# Altium schematic sheet Sheet1.SchDoc
size A4
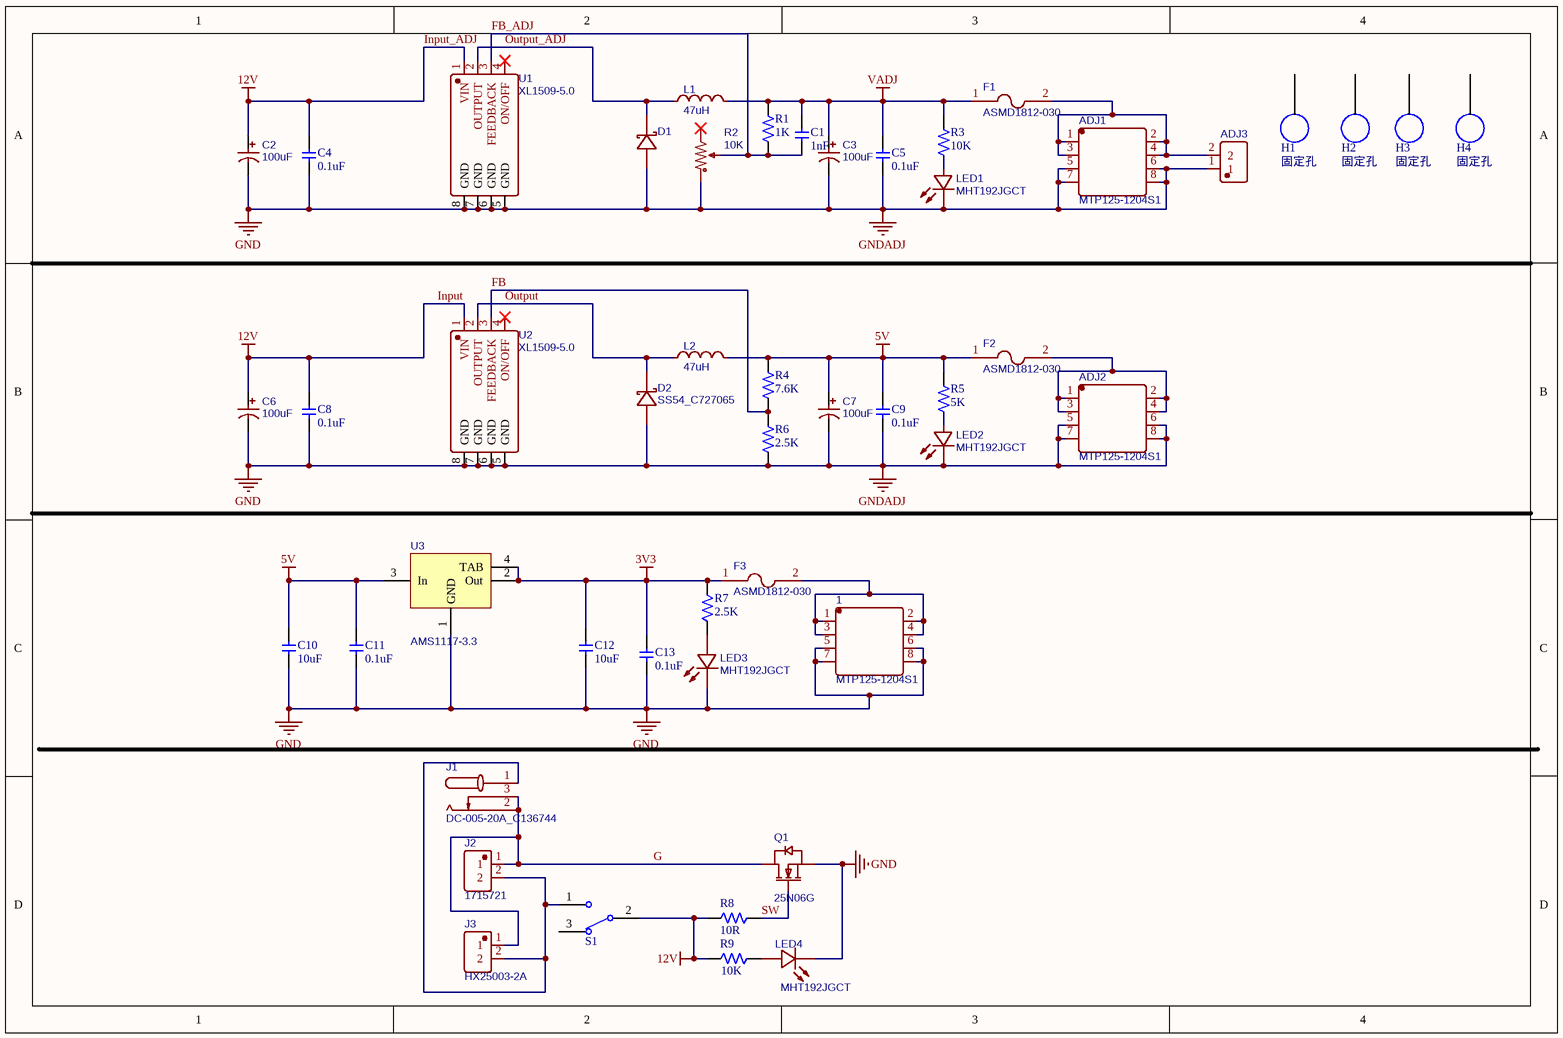
[diagram p0: Sheet1.SchDoc]

## Parts
1  MTP125-1204S1  [HDR-TH_8P-P2.54-V-F-R2-C4-S2.54-1]
ADJ1  MTP125-1204S1  [HDR-TH_8P-P2.54-V-F-R2-C4-S2.54-1]
ADJ2  MTP125-1204S1  [HDR-TH_8P-P2.54-V-F-R2-C4-S2.54-1]
ADJ3  1125-1102G0S116C001  [焊盘 2p]  (value not drawn)
C1  1nF  [0603C]
C2  100uF  [CAP-SMD_BD6.3-L6.6-W6.6-FD]
C3  100uF  [CAP-SMD_BD6.3-L6.6-W6.6-FD]
C4  0.1uF  [0603C]
C5  0.1uF  [0603C]
C6  100uF  [CAP-SMD_BD6.3-L6.6-W6.6-FD]
C7  100uF  [CAP-SMD_BD6.3-L6.6-W6.6-FD]
C8  0.1uF  [0603C]
C9  0.1uF  [0603C]
C10  10uF  [0603C]
C11  0.1uF  [0603C]
C12  10uF  [0603C]
C13  0.1uF  [0603C]
D1  SS54_C727065  [SMA_L4.3-W2.6-LS5.0-RD]  (value not drawn)
D2  SS54_C727065  [SMA_L4.3-W2.6-LS5.0-RD]
F1  ASMD1812-030  [F1812]
F2  ASMD1812-030  [F1812]
F3  ASMD1812-030  [F1812]
H1  固定孔  [Gp-t]
H2  固定孔  [Gp-t]
H3  固定孔  [Gp-t]
H4  固定孔  [Gp-t]
J1  DC-005-20A_C136744  [DC-IN-TH_DC-005-20A]
J2  1715721  [KF301-5.0-2P]
J3  HX25003-2A  [XH2.54-WI-2P]
L1  47uH  [IND-SMD_L7.1-W6.6]
L2  47uH  [IND-SMD_L7.1-W6.6]
LED1  MHT192JGCT  [LED0603-RD]
LED2  MHT192JGCT  [LED0603-RD]
LED3  MHT192JGCT  [LED0603-RD]
LED4  MHT192JGCT  [LED0603-RD]
Q1  25N06G  [TO-252-2_L6.6-W6.1-P4.57-LS9.9-BR-CW]
R1  1K  [0603R]
R2  10K  [RES-ADJ-TH_3P-L10.0-W10.0-P2.50-L]
R3  10K  [0603R]
R4  7.6K  [0603R]
R5  5K  [0603R]
R6  2.5K  [0603R]
R7  2.5K  [0603R]
R8  10R  [0603R]
R9  10K  [0603R]
S1  SW-SPDT  [钮子开关]  (value not drawn)
U1  XL1509-5.0  [SOIC-8_L5.0-W4.0-P1.27-LS6.0-BL]
U2  XL1509-5.0  [SOIC-8_L5.0-W4.0-P1.27-LS6.0-BL]
U3  AMS1117-3.3  [AMS1117]

## Nets
3V3: C12.2 C13.2 F3.1 R7.1 U3.2(Out) U3.4(TAB)
5V: C7.1 C9.2 C10.2 C11.2 F2.1 L2.2 R4.1 R5.1 U3.3(In)
GND: 1.5 1.6 1.7 1.8 ADJ1.5 ADJ1.6 ADJ1.7 ADJ1.8 ADJ2.5 ADJ2.6 ADJ2.7 ADJ2.8 ADJ3.1 C2.2 C3.2 C4.1 C5.1 C6.2 C7.2 C8.1 C9.1 C10.1 C11.1 C12.1 C13.1 D1.2 D2.2 LED1.1(-) LED2.1(-) LED3.1(-) LED4.1(-) Q1.3(S) R2.1 R6.2 U1.5(GND) U1.6(GND) U1.7(GND) U1.8(GND) U2.5(GND) U2.6(GND) U2.7(GND) U2.8(GND) U3.1(GND)  [also labelled GNDADJ]
Input: C2.1 C4.2 C6.1 C8.2 R8.2 R9.2 S1.2 U1.1(VIN) U2.1(VIN)  [also labelled 12V, Input_ADJ]
VADJ: C1.2 C3.1 C5.2 F1.1 L1.2 R1.1 R3.1
FB: R4.2 R6.1 U2.3(FEEDBACK)
FB_ADJ: C1.1 R1.2 R2.2 U1.3(FEEDBACK)
G: J1.2 J1.3 J2.1 J3.1 Q1.2(D)
Output: D2.1 L2.1 U2.2(OUTPUT)
Output_ADJ: D1.1 L1.1 U1.2(OUTPUT)
SW: Q1.1(G) R8.1
Net1_1: 1.1 1.2 1.3 1.4 F3.2
NetADJ1_1: ADJ1.1 ADJ1.2 ADJ1.3 ADJ1.4 ADJ3.2 F1.2
NetADJ2_1: ADJ2.1 ADJ2.2 ADJ2.3 ADJ2.4 F2.2
NetJ1_1: J1.1 J2.2 J3.2 S1.1
NetLED1_2: LED1.2(+) R3.2
NetLED2_2: LED2.2(+) R5.2
NetLED3_2: LED3.2(+) R7.2
NetLED4_2: LED4.2(+) R9.1

Not connected (* = marked no-connect by the designer): H1 1; H2 1; H3 1; H4 1; R2 3*; S1 3; U1 4(ON/OFF)*; U2 4(ON/OFF)*

## Notes on the sheet
- Title
- Size:
- Date:
- A4
- Number:
- Time:
- Revision:
- Sheet
- of
- File:

## Library data of the parts
1 ADJ1 ADJ2 = MTP125-1204S1: 插针-弯; BOM_Manufacturer: MINTRON; Contributor: LCSC; BOM_Supplier: LCSC; BOM_Supplier Part: C358693; BOM_Manufacturer Part: MTP125-1204S1; BOM_JLCPCB Part Class: Extended Part; spicePre: U; spiceSymbolName: MTP125-1204S1
ADJ3 = 焊盘 2p: 毫伏电压表焊盘; BOM_Manufacturer: Wcon(维峰电子); Contributor: LCSC; BOM_Supplier: LCSC; BOM_Supplier Part: C920781; BOM_Manufacturer Part: 1125-1102G0S116C001; spicePre: H; spiceSymbolName: 1125-1102G0S116C001
C1 C4 C5 C8-C13 = C
C2 C3 C6 C7 = 100uF: BOM_Manufacturer: SEMTECH; BOM_Manufacturer Part: CK1C101M-CRE54; nameAlias: Capacitance; Contributor: LCSC; BOM_Supplier: LCSC; BOM_Supplier Part: C129250; BOM_JLCPCB Part Class: Extended Part; spicePre: C; spiceSymbolName: CK1C101M-CRE54
D1 D2 = SS54_C727065: 肖特基二极管; BOM_Manufacturer: TWGMC; BOM_Manufacturer Part: SS54; Contributor: LCSC; BOM_Supplier: LCSC; BOM_Supplier Part: C727065; BOM_JLCPCB Part Class: Extended Part; spicePre: D; spiceSymbolName: SS54_C727065
F1-F3 = ASMD1812-030: BOM_Manufacturer: JDTFUSE; Contributor: LCSC; BOM_Supplier: LCSC; BOM_Manufacturer Part: ASMD1812-030; BOM_Supplier Part: C135357; BOM_JLCPCB Part Class: Extended Part; spicePre: F; spiceSymbolName: ASMD1812-030
J1 = DC-005-20A_C136744: BOM_Manufacturer: HRO; Contributor: LCSC; BOM_Supplier: LCSC; BOM_Manufacturer Part: DC-005-20A; BOM_Supplier Part: C136744; BOM_JLCPCB Part Class: Extended Part; spicePre: D; spiceSymbolName: DC-005-20A_C136744
J2 = 1715721: BOM_Manufacturer: Phoenix Contact; Contributor: LCSC; BOM_Supplier: LCSC; BOM_Supplier Part: C480516; BOM_Manufacturer Part: 1715721; BOM_JLCPCB Part Class: Extended Part; spicePre: U; spiceSymbolName: 1715721
J3 = HX25003-2A: BOM_Manufacturer: HX(Zhejiang Yueqing Hongxing Elec); Contributor: LCSC; BOM_Supplier: LCSC; BOM_Supplier Part: C442299; BOM_Manufacturer Part: HX25003-2A; BOM_JLCPCB Part Class: Extended Part; spicePre: C; spiceSymbolName: HX25003-2A
L1 L2 = 33uH: BOM_Manufacturer: SXN; BOM_Manufacturer Part: SMMS0650-330M; nameAlias: Inductance; BOM_Supplier: LCSC; BOM_Supplier Part: C149587; BOM_JLCPCB Part Class: Extended Part; spicePre: L; spiceSymbolName: SMMS0650-330M
LED1-LED4 = MHT192JGCT: BOM_Manufacturer: MEIHUA; Contributor: LCSC; BOM_Supplier: LCSC; BOM_Supplier Part: C473820; BOM_Manufacturer Part: MHT192JGCT; BOM_JLCPCB Part Class: Extended Part; spicePre: L; spiceSymbolName: MHT192JGCT
Q1 = 25N06G: BOM_Manufacturer: Chongqing Pingwei Tech; Contributor: LCSC; BOM_Supplier: LCSC; BOM_Supplier Part: C432617; BOM_Manufacturer Part: 25N06G; BOM_JLCPCB Part Class: Extended Part; spicePre: Q; spiceSymbolName: 25N06G
R1 R3-R9 = R
R2 = 10K: 电位器; BOM_Manufacturer: Chengdu Guosheng Tech; BOM_Manufacturer Part: 3296W-1-103; nameAlias: Resistance (Ohms); Contributor: LCSC; BOM_Supplier: LCSC; BOM_Supplier Part: C118954; Resistance(Ohms): 10K; BOM_JLCPCB Part Class: Extended Part; spicePre: R; spiceSymbolName: 3296W-1-103
S1 = SW-SPDT: 单刀双掷开关 3脚船型、钮子、拨动开关 SPDT Subminiature Toggle Switch; Published: 24-Mar-1999; Publisher: Altium Limited; Price(RMB): 0.000
U1 U2 = XL1509-5.0: 开关电源3A; BOM_Manufacturer: UMW(友台半导体); Contributor: LCSC; BOM_Supplier: LCSC; BOM_Supplier Part: C2681225; BOM_Manufacturer Part: XL1509-5.0; BOM_JLCPCB Part Class: Extended Part; spicePre: U; spiceSymbolName: XL1509-5.0
U3 = AMS1117-3.3_C165482: 3.3V稳压芯片; BOM_Manufacturer: SK; Contributor: LCSC; SMT Type: Extend; BOM_Supplier: LCSC; BOM_Supplier Part: C165482; BOM_Manufacturer Part: AMS1117-3.3; BOM_LCSC Assembly: Yes; spicePre: U; spiceSymbolName: AMS1117-3.3_C165482